# Altium project doc_high-speed-thermocouple-logger.PrjPcb (part 1 of 3)
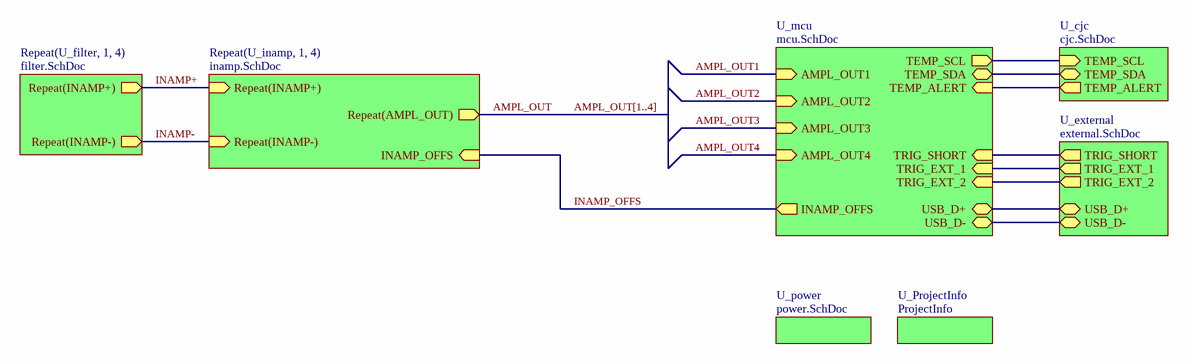
[diagram p0: Top.SchDoc]
CheckedBy: Boris Botev; Date: 2024-05-30; DrawnBy: Iliyan Antov; DrawnByID: IA; Project: V286; Revision: 100; Title: tclogger
8 sheets, 226 parts. Net scope: hierarchical (ports join the sheet entries above them; power ports are global).
Sheets:
  Top.SchDoc
    U_ProjectInfo = ProjectInfo.SchDoc
    U_filter1 = filter.SchDoc
    U_filter2 = filter.SchDoc
    U_filter3 = filter.SchDoc
    U_filter4 = filter.SchDoc
    U_power = power.SchDoc
    U_mcu = mcu.SchDoc
    U_external = external.SchDoc
  C_76p593.SchDoc
  C_376p667.SchDoc

## Sheet Top.SchDoc: tclogger
size A4; Date: 2024-05-30; CheckedBy: Boris Botev; DrawnBy: Iliyan Antov; Organization: Medical Technologies CZ a.s.; Revision: 100; SheetNumber: 1; SheetTotal: 10; Version1: N/A; Version2: N/A; Version3: N/A; Change1description: N/A; Change2description: N/A; Change3description: N/A; Change1DrawnBy: N/A; Change2DrawnBy: N/A; Change3DrawnBy: N/A; Change1CheckedBy: N/A; Change2CheckedBy: N/A; Change3CheckedBy: N/A; PreviusVersion_Chng1: N/A; PreviusVersion_Chng2: N/A; PreviusVersion_Chng3: N/A; Variant1description: Standard assembly; Variant2description: N/A; Variant3description: N/A; Variant4description: N/A; PrimaryCard1: XXXxxxXXX; PrimaryCard2: N/A; PrimaryCard3: N/A; PrimaryCard4: N/A; DocumentName: Docname

### Sub-sheets
Repeat(U_filter, 1, 4) = filter.SchDoc: Repeat(INAMP+) (out), Repeat(INAMP-) (out)
Repeat(U_inamp, 1, 4) = inamp.SchDoc (file not in this document): Repeat(INAMP-) (in), Repeat(INAMP+) (in), Repeat(AMPL_OUT) (out), INAMP_OFFS (in)
U_cjc = cjc.SchDoc (file not in this document): TEMP_SCL (in), TEMP_SDA (bidir), TEMP_ALERT (out)
U_external = external.SchDoc: USB_D+ (bidir), USB_D- (bidir), TRIG_SHORT (out), TRIG_EXT_1 (out), TRIG_EXT_2 (out)
U_mcu = mcu.SchDoc: AMPL_OUT1 (in), AMPL_OUT2 (in), AMPL_OUT3 (in), AMPL_OUT4 (in), TEMP_ALERT (in), TEMP_SCL (out), TEMP_SDA (bidir), USB_D+ (bidir), USB_D- (bidir), TRIG_SHORT (in), TRIG_EXT_1 (in), TRIG_EXT_2 (in), INAMP_OFFS (out)
U_power = power.SchDoc: no entries
U_ProjectInfo = ProjectInfo: no entries

### Nets
AMPL_OUT: sheet Repeat(U_inamp, 1, 4)/Repeat(AMPL_OUT)
INAMP+: sheet Repeat(U_filter, 1, 4)/Repeat(INAMP+), sheet Repeat(U_inamp, 1, 4)/Repeat(INAMP+)
INAMP-: sheet Repeat(U_filter, 1, 4)/Repeat(INAMP-), sheet Repeat(U_inamp, 1, 4)/Repeat(INAMP-)
INAMP_OFFS: sheet Repeat(U_inamp, 1, 4)/INAMP_OFFS, sheet U_mcu/INAMP_OFFS
USB_D_N: sheet U_mcu/USB_D-, sheet U_external/USB_D-
USB_D_P: sheet U_mcu/USB_D+, sheet U_external/USB_D+
NetCK41_1: sheet U_mcu/TRIG_SHORT, sheet U_external/TRIG_SHORT
NetR29_1: sheet U_mcu/TRIG_EXT_1, sheet U_external/TRIG_EXT_1
NetR30_1: sheet U_mcu/TRIG_EXT_2, sheet U_external/TRIG_EXT_2
NetU7_40: sheet U_cjc/TEMP_SCL, sheet U_mcu/TEMP_SCL
NetU7_41: sheet U_cjc/TEMP_SDA, sheet U_mcu/TEMP_SDA
NetU7_42: sheet U_cjc/TEMP_ALERT, sheet U_mcu/TEMP_ALERT

### Buses and harness runs
bus AMPL_OUT[1..4]

### Notes on the sheet
- Číslo výkresu /drawing number/:
- Nazev listu/sheet name/:
- DPS projekt/PCB project/:
- Kreslil /drawn by/ :
- Kontroloval /checked by/:
- Datum /date/:
- List /sheet/:
- /

## Sheet ProjectInfo.SchDoc: tclogger
size A4; Date: 2024-05-30; CheckedBy: Boris Botev; DrawnBy: Iliyan Antov; Organization: Medical Technologies CZ a.s.; DocumentNumber: ?; Revision: 100; SheetNumber: 2; SheetTotal: 10; Version1: N/A; Version2: N/A; Version3: N/A; Change1description: N/A; Change2description: N/A; Change3description: N/A; Change1DrawnBy: N/A; Change2DrawnBy: N/A; Change3DrawnBy: N/A; Change1CheckedBy: N/A; Change2CheckedBy: N/A; Change3CheckedBy: N/A; PreviusVersion_Chng1: N/A; PreviusVersion_Chng2: N/A; PreviusVersion_Chng3: N/A; Variant1description: Standard assembly; Variant2description: N/A; Variant3description: N/A; Variant4description: N/A; PrimaryCard1: XXXxxxXXX; PrimaryCard2: N/A; PrimaryCard3: N/A; PrimaryCard4: N/A; DocumentName: Docname
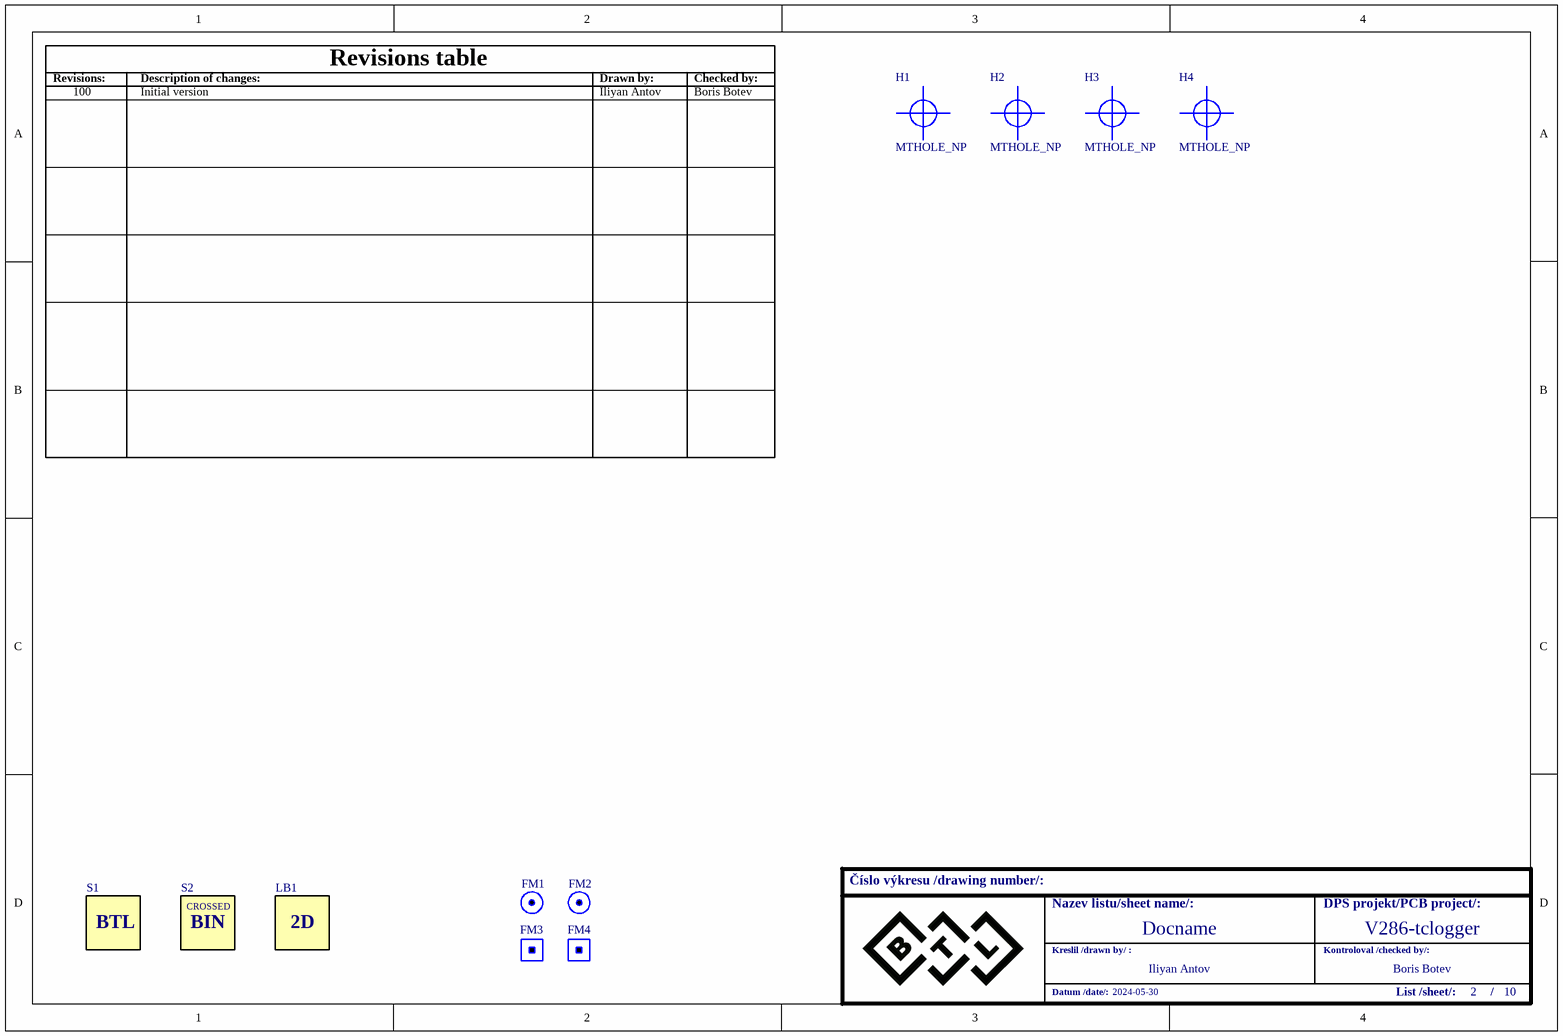
[diagram p1: ProjectInfo.SchDoc]

### Parts
FM1  Fiducial Mark Circle  [FM_CIRCLE_BTL]  (value not drawn)
FM2  Fiducial Mark Circle  [FM_CIRCLE_BTL]  (value not drawn)
FM3  Fiducial Mark Square  [FM_SQUARE_BTL]  (value not drawn)
FM4  Fiducial Mark Square  [FM_SQUARE_BTL]  (value not drawn)
H1  MTHOLE_NP  [HOLE3.5MM_NONPLATED]  (no BOM)
H2  MTHOLE_NP  [HOLE3.5MM_NONPLATED]  (no BOM)
H3  MTHOLE_NP  [HOLE3.5MM_NONPLATED]  (no BOM)
H4  MTHOLE_NP  [HOLE3.5MM_NONPLATED]  (no BOM)
LB1  LABEL_MATRIX_CODE  [MATRIX_CODE]  (value not drawn)  (no BOM)
S1  SYMBOL_LOGO_BTL  [BTL_LOGO_3MM]  (value not drawn)  (no BOM)
S2  SYMBOL_CROSSED_BIN  [CROSSED_BIN]  (value not drawn)  (no BOM)

### Nets

Not connected (* = marked no-connect by the designer): H1 #; H2 #; H3 #; H4 #

### Notes on the sheet
- Revisions:
- 100
- Description of changes:
- Initial version
- Revisions table
- Drawn by:
- Iliyan Antov
- Checked by:
- Boris Botev
- Číslo výkresu /drawing number/:
- Nazev listu/sheet name/:
- DPS projekt/PCB project/:
- Kreslil /drawn by/ :
- Kontroloval /checked by/:
- Datum /date/:
- List /sheet/:
- /
- (in symbol 000-SPACE2D100) 2D
- (in symbol 000-SYMBIN100) CROSSED; BIN
- (in symbol 000-SYMBTL100) BTL

### Library data of the parts
FM1 FM2 = 000+FMC100: De; Fiducial Mark;; Component_Class: Design Entity; Status_I: Development; Status_II: Testing; KK: 000+FMC100; Value: Fiducial Mark Circle; SMD: 1; Entity_Type: Fiducial Mark; ComponentLink1URL: heliosgreen://v1/hegMT/5-MT/Classes(343)/Folders/OpenForm?RecordNumbers=[12022158]; ComponentLink1Description: Helios
FM3 FM4 = 000+FMS100: De; Fiducial Mark;; Component_Class: Design Entity; Status_I: Development; Status_II: Testing; KK: 000+FMS100; Value: Fiducial Mark Square; SMD: 1; Entity_Type: Fiducial Mark; ComponentLink1URL: heliosgreen://v1/hegMT/5-MT/Classes(343)/Folders/OpenForm?RecordNumbers=[12022164]; ComponentLink1Description: Helios
H1-H4 = 000-HOLE3.5NP100: De; Hole;; Note: Hole 3,5mm, Nonplated; Component_Class: Design Entity; Status_I: Development; Status_II: Approval pending; KK: 000-HOLE3.5NP100; Value: MTHOLE_NP; SMD: 0; Entity_Type: Hole; ComponentLink1URL: heliosgreen://v1/hegMT/5-MT/Classes(343)/Folders/OpenForm?RecordNumbers=[13035934]; ComponentLink1Description: Helios
LB1 = 000-SPACE2D100: De; Space for...;; Note: Space for 2D code sticker; Component_Class: Design Entity; Status_I: Development; Status_II: Testing; KK: 000-SPACE2D100; Value: LABEL_MATRIX_CODE; SMD: 0; Entity_Type: Space for...; ComponentLink1URL: heliosgreen://v1/hegMT/5-MT/Classes(343)/Folders/OpenForm?RecordNumbers=[12022194]; ComponentLink1Description: Helios
S1 = 000-SYMBTL100: De; Symbols/Tables;; Note: Symbol BTL logos for silkscreen or Copper; Component_Class: Design Entity; Status_I: Development; Status_II: Testing; KK: 000-SYMBTL100; Value: SYMBOL_LOGO_BTL; SMD: 0; Entity_Type: Symbols/Tables; ComponentLink1URL: heliosgreen://v1/hegMT/5-MT/Classes(343)/Folders/OpenForm?RecordNumbers=[12022368]; ComponentLink1Description: Helios
S2 = 000-SYMBIN100: De; Symbols/Tables;; Note: Symbol Crossed Bin; Component_Class: Design Entity; Status_I: Development; Status_II: Testing; KK: 000-SYMBIN100; Value: SYMBOL_CROSSED_BIN; SMD: 0; Entity_Type: Symbols/Tables; ComponentLink1URL: heliosgreen://v1/hegMT/5-MT/Classes(343)/Folders/OpenForm?RecordNumbers=[12022356]; ComponentLink1Description: Helios

## Sheet filter.SchDoc: tclogger
size A4; Date: 2024-05-30; CheckedBy: Boris Botev; DrawnBy: Iliyan Antov; Organization: Medical Technologies CZ a.s.; Revision: 100; SheetNumber: 4; SheetTotal: 10; Version1: N/A; Version2: N/A; Version3: N/A; Change1description: N/A; Change2description: N/A; Change3description: N/A; Change1DrawnBy: N/A; Change2DrawnBy: N/A; Change3DrawnBy: N/A; Change1CheckedBy: N/A; Change2CheckedBy: N/A; Change3CheckedBy: N/A; PreviusVersion_Chng1: N/A; PreviusVersion_Chng2: N/A; PreviusVersion_Chng3: N/A; Variant1description: Standard assembly; Variant2description: N/A; Variant3description: N/A; Variant4description: N/A; PrimaryCard1: XXXxxxXXX; PrimaryCard2: N/A; PrimaryCard3: N/A; PrimaryCard4: N/A; SPICEModelCacheFNHWHFZR: <root> / <DocumentId>FNHWHFZR</DocumentId> / <CacheFrame Number="0"> / <Model Name="1812_744235110_5000ohm" Kind="CKT"> / <Text>.subckt 1812_744235110_5000ohm 1 2 3 4  PARAMS: / +  L1=8.85047647829296E-06 / +  L2=0.0000034430683879953 / +  L3=3.38096411330201E-08 / +  L4=1.00652585896406E-08 / +  C1=1.31229796204887E-13 / +  RS1=7427.18723080165 / +  RS2=1810.64222257634 / +  RS3=34746.6565929217 / +  RS4=3695.42782092552 / +  R2=216.5 / +  DL3=2.01815820812556E-09 / +  DC3=3.07079198420314E-12 / +  DR3=155.69656586632 / +  DR4=156.010213182894 / +  Rdc=0.501580452433977 / +  ck=2.0478163676467E-11 / R_R47  N21893  N21911  {Rs3} / R_R43  N21425  N21441  {Rs2} / R_R4  N22217  N21871  {dR3} / L_L3  N21425  N21441  {L2} / L_L8  N21871  N21893  {L4} / Kn_K1  L_L1  L_L2  1 / R_R37  N21241  3  {R2} / R_R48  N21911  N21925  {Rs2} / R_R44  N21441  3  {Rs1} / C_C4  N21871  N22231  {C1} / L_L1  N21441  3  {L1} / C_C1  N21207  N21217  {dC3} / L_L6  N21893  N21911  {L3} / R_R1  1  N21207  {Rdc} / L_L17  N21207  N21585  {dL3} / R_R49  N21925  4  {Rs1} / Kn_K5 L_L17 L_L18 0.9999 / Kn_K6 L_L17 L_L19 0.9999 / Kn_K7 L_L17 L_L20 0.9999 / Kn_K8 L_L18 L_L19 0.9999 / Kn_K9 L_L18 L_L20 0.9999 / Kn_K10 L_L19 L_L20 0.9999 / R_R3  N21217  N21223  {dR3} / R_R55  N22231  4  {R2} / L_L4  N21911  N21925  {L2} / R_R2  N21207  N21223  {dR4} / L_L19  N21585  N21223  {dL3} / R_R6  2  N21857  {Rdc} / C_C2  N21731  N21585  {ck} / Kn_K4  L_L7  L_L8  1 / L_L2  N21925  4  {L1} / R_R41  N21223  N21413  {Rs4} / L_L7  N21223  N21413  {L4} / R_R5  N21857  N21871  {dR4} / L_L18  N21731  N21857  {dL3} / Kn_K3  L_L5  L_L6  1 / R_R46  N21871  N21893  {Rs4} / R_R42  N21413  N21425  {Rs3} / L_L5  N21413  N21425  {L3} / C_C9  N21857  N22217  {dC3} / L_L20  N21871  N21731  {dL3} / Kn_K2  L_L3  L_L4  1 / C_C3  N21223  N21241  {C1} / .ends 1812_744235110_5000ohm</Text> / </Model> / <Model Name="cl10b224ko8nnn" Kind="CKT"> / <Text>* CL10B224KO8NNN Multilayer Ceramic Capacitor Spice Model / *----------------------------------------------------------------------------------------------- / * Model Generated by Samsung Electro-Mechanics / * Samsung Spice Model Version 5.0 / * Date : Sep-26-2020 / * Products : Multilayer Ceramic Capacitor(General) / *----------------------------------------------------------------------------------------------- / * Characteristics : / * / *     Nominal Capacitance = 220nF / *     Capacitance Tolerance = +/-10% / *     TCC = X7R(-55 ~ +125 degC.) / *     Rated Voltage = 16Vdc / *     Size = 0603(unit:inch), 1608(unit:mm) / *     Length = 1.60+/-0.10mm / *     Width = 0.80+/-0.10mm / *     Thickness = 0.80+/-0.10mm / *     Measurement Temperature : 25degC. / *     DC bias Value = 0V / *     Frequency : 300Hz ~ 6GHz / *----------------------------------------------------------------------------------------------- / * External Node Assignments : / * / *  1  o---||---o  2 / * / *----------------------------------------------------------------------------------------------- / .SUBCKT CL10B224KO8NNN 1 2 / C1 1 3 2.12811E-7 / C2 3 4 4.50839E-6 / C3 4 5 7.37628E-6 / C4 5 6 1.15740E-5 / C5 6 7 8.21856E-6 / C6 7 8 1.49560E-6 / C7 8 9 1.0E-10 / C8 9 10 1.0E-10 / C16 17 18 4.28299E-5 / C17 18 19 0.00218 / C18 19 20 2.53303E-4 / C19 20 21 2.53303E-4 / C20 21 22 2.53303E-4 / C21 22 23 2.53303E-4 / C22 23 24 2.53303E-4 / C23 24 25 1.40386E-6 / C24 25 26 2.45886E-7 / C25 26 27 2.53303E-4 / C26 27 28 7.70224E-12 / C27 28 2 9.10213E-12 / L10 11 12 1.06621E-10 / L11 12 13 1.56523E-10 / L12 13 14 2.14472E-11 / L13 14 15 1.0E-10 / L14 15 16 1.0E-10 / L15 16 17 1.0E-10 / L16 17 18 3.49236E-10 / L17 18 19 2.37243E-12 / L18 19 20 1.0E-10 / L19 20 21 1.0E-10 / L20 21 22 1.0E-10 / L21 22 23 1.0E-10 / L22 23 24 1.0E-10 / L23 24 25 1.67603E-11 / L24 25 26 4.35819E-11 / L25 26 27 1.0E-10 / L26 27 28 5.54700E-11 / L27 28 2 9.20069E-11 / R1 1 3 1.0E8 / R2 3 4 164.97574 / R3 4 5 8.00726 / R4 5 6 0.53476 / R5 6 7 0.05878 / R6 7 8 0.00650 / R7 8 9 1.0E-6 / R8 9 10 1.0E-6 / R9 10 11 0.00774 / R11 12 13 0.06260 / R12 13 14 0.08187 / R13 14 15 1.0E-6 / R14 15 16 1.0E-6 / R15 16 17 1.0E-6 / R16 17 18 0.00281 / R17 18 19 9.83794E-4 / R18 19 20 1.0E-6 / R19 20 21 1.0E-6 / R20 21 22 1.0E-6 / R21 22 23 1.0E-6 / R22 23 24 1.0E-6 / R23 24 25 0.01140 / R24 25 26 0.02076 / R25 26 27 1.0E-6 / R26 27 28 23.64485 / R27 28 2 6.29425 / .ENDS CL10B224KO8NNN</Text> / </Model> / </CacheFrame> / </root>; DocumentName: Docname
Used 4 times, as channels U_filter1, U_filter2, U_filter3, U_filter4. Parts and nets are listed once, with the designators drawn on the sheet.
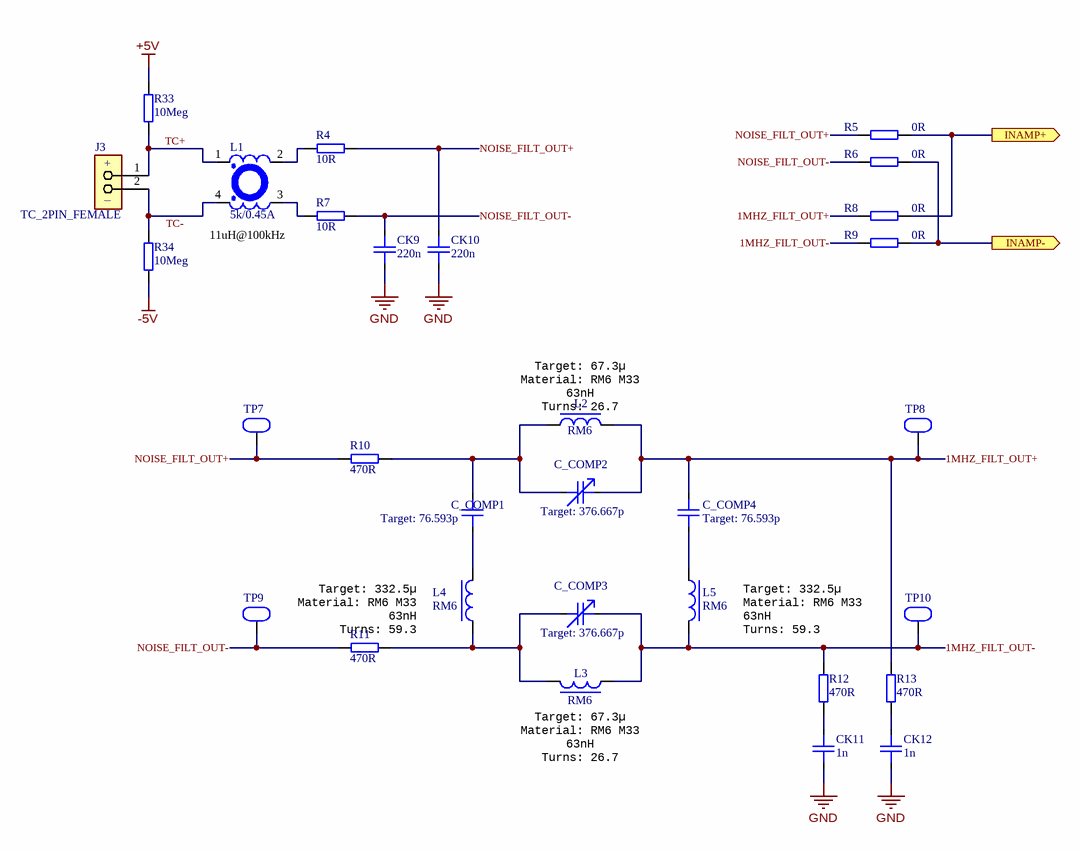
[diagram p2: filter.SchDoc]

### Parts
C_COMP1  Target: 76.593p  [CAPC1005X06N(SMC0402)]
C_COMP2  Target: 376.667p  [CTSC3S]
C_COMP3  Target: 376.667p  [CTSC3S]
C_COMP4  Target: 76.593p  [CAPC1005X06N(SMC0402)]
CK9  220n  [CAPC1608X09N(SMC0603)]
CK10  220n  [CAPC1608X09N(SMC0603)]
CK11  1n  [CAPC2012X14N(SMC0805)]
CK12  1n  [CAPC2012X14N(SMC0805)]
J3  TC_2PIN_FEMALE  [TC_PCC-SMD]
L1  5k/0.45A  [WE_744235110]
L2  RM6  [INDP1616X10N]
L3  RM6  [INDP1616X10N]
L4  RM6  [INDP1616X10N]
L5  RM6  [INDP1616X10N]
R4  10R  [RESC2012X06N(SMR0805)]
R5  0R  [RESC2012X06N(SMR0805)]
R6  0R  [RESC2012X06N(SMR0805)]
R7  10R  [RESC2012X06N(SMR0805)]
R8  0R  [RESC2012X06N(SMR0805)]
R9  0R  [RESC2012X06N(SMR0805)]
R10  470R  [RESC1608X06N(SMR0603)]
R11  470R  [RESC1608X06N(SMR0603)]
R12  470R  [RESC1608X06N(SMR0603)]
R13  470R  [RESC1608X06N(SMR0603)]
R33  10Meg  [RESC2012X06N(SMR0805)]
R34  10Meg  [RESC2012X06N(SMR0805)]
TP7  Test Point  [SMD_Testpoint_Onelayer]  (value not drawn)
TP8  Test Point  [SMD_Testpoint_Onelayer]  (value not drawn)
TP9  Test Point  [SMD_Testpoint_Onelayer]  (value not drawn)
TP10  Test Point  [SMD_Testpoint_Onelayer]  (value not drawn)

### Ports
INAMP+ (out), INAMP- (out)

### Nets
+5V: R33.2
-5V: R34.1
GND: CK9.2 CK10.2 CK11.1 CK12.1
1MHZ_FILT_OUT+: C_COMP2.1 C_COMP4.1 L2.2(L1B) R8.1 R13.2 TP8.1
1MHZ_FILT_OUT-: C_COMP3.1 L3.2(L1B) L5.1(L1A) R9.1 R12.2 TP10.1
INAMP+: R5.2 R8.2 ; port INAMP+
INAMP-: R6.2 R9.2 ; port INAMP-
NOISE_FILT_OUT+: CK10.1 R4.1 R5.1 R10.1 TP7.1
NOISE_FILT_OUT-: CK9.1 R6.1 R7.2 R11.1 TP9.1
TC+: J3.1 L1.1(L1A) R33.1
TC-: J3.2 L1.4(L2B) R34.2
NetC_COMP1_1: C_COMP1.1 C_COMP2.2 L2.1(L1A) R10.2
NetC_COMP1_2: C_COMP1.2 L4.2(L1B)
NetC_COMP3_2: C_COMP3.2 L3.1(L1A) L4.1(L1A) R11.2
NetC_COMP4_2: C_COMP4.2 L5.2(L1B)
NetCK11_2: CK11.2 R12.1
NetCK12_2: CK12.2 R13.1
NetL1_2: L1.2(L1B) R4.2
NetL1_3: L1.3(L2A) R7.1

### Channels
U_filter1: designators end in A; ports INAMP+=INAMP+1 INAMP-=INAMP-1
U_filter2: designators end in B; ports INAMP+=INAMP+2 INAMP-=INAMP-2
U_filter3: designators end in C; ports INAMP+=INAMP+3 INAMP-=INAMP-3
U_filter4: designators end in D; ports INAMP+=INAMP+4 INAMP-=INAMP-4

### Notes on the sheet
- 11uH@100kHz
- (near L2) Target: 67.3µ
  Material: RM6 M33 63nH
  Turns: 26.7
- (near TP9) Target: 332.5µ
  Material: RM6 M33 63nH
  Turns: 59.3
- (near TP10) Target: 332.5µ
  Material: RM6 M33 63nH
  Turns: 59.3
- (near L3) Target: 67.3µ
  Material: RM6 M33 63nH
  Turns: 26.7
- Číslo výkresu /drawing number/:
- Nazev listu/sheet name/:
- DPS projekt/PCB project/:
- Kreslil /drawn by/ :
- Kontroloval /checked by/:
- Datum /date/:
- List /sheet/:
- /
- (in symbol TC_2PIN_FEMALE) +; –

### Library data of the parts
C_COMP1 C_COMP4 = ECK+470P50V0402XX0: C; 470p; 50V; 1%; NP0/C0G; ??;; Manufacturer: Kemet: C0402C471F5GAC7867;;Murata: GRM1555C1H471FA01D; Component_Class: Capacitor; Status_I: Production; Status_II: Active; Tolerance_Pct: 1; Voltage_Rating_V: 50; Capacitance_F: 4.7E-10; KK: ECK+470P50V0402XX0; Value: 470p; SMD: 1; ComponentLink2URL: I:\DataSheets\ECK+470P50V0402XX0_KemetEN100.pdf; ComponentLink2Description: ECK+470P50V0402XX0_KemetEN100.pdf; ComponentLink3URL: I:\DataSheets\ECK+470P50V0402XX0_MurataEN100.pdf; ComponentLink3Description: ECK+470P50V0402XX0_MurataEN100.pdf; ComponentLink4URL: i:\DataSheets\ECK+470P50V0402XX0_2_KemetEN100.pdf; ComponentLink4Description: ECK+470P50V0402XX0_2_KemetEN100.pdf; ComponentLink5URL: i:\DataSheets\ECK+470P50V0402XX0_2_MurataEN100.pdf; ComponentLink5Description: ECK+470P50V0402XX0_2_MurataEN100.pdf; Dielectric_Type: NP0/C0G; ComponentLink1URL: heliosgreen://v1/hegMT/5-MT/Classes(343)/Folders/OpenForm?RecordNumbers=[14965054]; ComponentLink1Description: Helios
C_COMP2 C_COMP3 = CTSC3S: 3.5 - 10pF, 50V; ComponentLink1Description: Datasheet; ComponentLink1URL: https://store.comet.bg/download-file.php?id=2362; Value: 3.5 - 10pF
CK9 CK10 = ECK+220N16VXX0: C; 220n; 16V; 10%; X7R; ??;; Manufacturer: TDK Corporation: C1608X7R1C224K080AC;;AVX Corporation: 0603YC224KAT2A;;Samsung: CL10B224KO8NNNC; Component_Class: Capacitor; Status_I: Production; Status_II: Active; Tolerance_Pct: 10; Voltage_Rating_V: 16; Capacitance_F: 2.2E-7; KK: ECK+220N16VXX0; Value: 220n; SMD: 1; ComponentLink2URL: i:\DataSheets\ECK+220N16VXX0_TDKEN100.pdf; ComponentLink2Description: ECK+220N16VXX0_TDKEN100.pdf; ComponentLink3URL: I:\DataSheets\ECK+220N16VXX0_AVXCorporationEN100.pdf; ComponentLink3Description: ECK+220N16VXX0_AVXCorporationEN100.pdf; ComponentLink4URL: I:\DataSheets\ECK+220N16VXX0_SamsungEN100.pdf; ComponentLink4Description: ECK+220N16VXX0_SamsungEN100.pdf; ComponentLink5URL: i:\DataSheets\ECK+220N16VXX0_2_SamsungEN100.pdf; ComponentLink5Description: ECK+220N16VXX0_2_SamsungEN100.pdf; Dielectric_Type: X7R; ComponentLink1URL: heliosgreen://v1/hegMT/5-MT/Classes(343)/Folders/OpenForm?RecordNumbers=[9390379]; ComponentLink1Description: Helios
CK11 CK12 = ECK+1N50VXXJ: C; 1n; 50V; 5%; NP0/C0G; ??;; Manufacturer: YAGEO: CC0805JRNPO9BN102;;AVX: 0805 5A 102 JAT2A; Component_Class: Capacitor; Status_I: Production; Status_II: Active; Tolerance_Pct: 5; Voltage_Rating_V: 50; Capacitance_F: 1E-9; KK: ECK+1N50VXXJ; Value: 1n; SMD: 1; ComponentLink2URL: i:\datasheets\ECK+1N50VXXJ_Yageo.pdf; ComponentLink2Description: ECK+1N50VXXJ_Yageo.pdf; ComponentLink3URL: i:\DataSheets\ECK+1N50VXXJ_2_YageoEN100.pdf; ComponentLink3Description: ECK+1N50VXXJ_2_YageoEN100.pdf; ComponentLink4URL: i:\DataSheets\ECK+1N50VXXJ_AVX_EN100.pdf; ComponentLink4Description: ECK+1N50VXXJ_AVX_EN100.pdf; Dielectric_Type: NP0/C0G; ComponentLink1URL: heliosgreen://v1/hegMT/5-MT/Classes(343)/Folders/OpenForm?RecordNumbers=[380366]; ComponentLink1Description: Helios
J3 = TC_2PIN_FEMALE: Universal SMD thermocouple connector, 2 pin, Female; Value: TC_2PIN_FEMALE; ComponentLink1Description: Datasheet; ComponentLink1URL: https://www.farnell.com/datasheets/2913879.pdf
L1 = EL+11U0.45ACM1812XX0: Flt; Common Mode Chokes; 0.8Ohm; 0.45A; 60V; 1x;; Manufacturer: Würth: 744235110; Note: 11uH, 0.45A, 5k@100MHz; Component_Class: Filter; Status_I: Production; Status_II: Active; Multiplicity: 1; Voltage_Rating_V: 60; Resistance_Ohm: 0.8; Current_Rating_A: 0.45; Mounting_Style: PCB; KK: EL+11U0.45ACM1812XX0; Value: 5k/0.45A; SMD: 1; ComponentLink2URL: i:\DataSheets\EL+11U0.45ACM1812XX0_WurthEN100.pdf; ComponentLink2Description: EL+11U0.45ACM1812XX0_WurthEN100.pdf; Filter_Type: Common Mode Chokes; ComponentLink1URL: heliosgreen://v1/hegMT/5-MT/Classes(343)/Folders/OpenForm?RecordNumbers=[12661641]; ComponentLink1Description: Helios
L2-L5 = EL+0.47U1.7AXX0: L; 0.47uH; 1.7A; 30%; 0.101Ohm; Fe; 1x;; Manufacturer: Wurth Elektronik: 784383130047; Component_Class: Inductor; Status_I: Production; Status_II: Do not order. Upon confirmation.; Tolerance_Pct: 30; Multiplicity: 1; Resistance_Ohm: 0.101; Current_Rating_A: 1.7; Inductance_H: 4.7E-7; KK: EL+0.47U1.7AXX0; Value: 0.47uH; SMD: 1; ComponentLink2URL: I:\DataSheets\EL+0.47U1.7AXX0_WurthElektronik_EN100.pdf; ComponentLink2Description: EL+0.47U1.7AXX0_WurthElektronik_EN100.pd; Core_Material: Fe; ComponentLink1URL: heliosgreen://v1/hegMT/5-MT/Classes(343)/Folders/OpenForm?RecordNumbers=[18782770]; ComponentLink1Description: Helios
R4 R7 = ER+10R0.1WXXF: R; 10R; 0.125W; 1%; 150V; Thick Film; ±200ppm/K; 1x;; Manufacturer: YAGEO: RC0805FR-1010RL;;YAGEO: RC0805FR-0710RL;;YAGEO: RC0805FR-1310RL;;AVX: CR21-0100F-T;;BC Components: MCU0805-50 1% P5 10R;;SAMSUNG: RC2012F100CS; Component_Class: Resistor; Status_I: Production; Status_II: Active; Tolerance_Pct: 1; Voltage_Rating_V: 150; Resistance_Ohm: 10; Power_Rating_W: 0.125; Temperature_Coefficient_PPMpK: ±200; KK: ER+10R0.1WXXF; Value: 10R; SMD: 1; ComponentLink2URL: i:\DataSheets\ER+0.1WXXF_Yageo.pdf; ComponentLink2Description: ER+0.1WXXF_Yageo.pdf; ComponentLink3URL: i:\datasheets\ER+10R0.1WXXF_SamsungEN100.pdf; ComponentLink3Description: ER+10R0.1WXXF_SamsungEN100.pdf; ComponentLink4URL: i:\DataSheets\ER+10R0.1WXXF_AvxEN100.pdf; ComponentLink4Description: ER+10R0.1WXXF_AvxEN100; Multiplicity: 1; Resistor_Type: Thick Film; ComponentLink1URL: heliosgreen://v1/hegMT/5-MT/Classes(343)/Folders/OpenForm?RecordNumbers=[381485]; ComponentLink1Description: Helios
R5 R6 R8 R9 = ER+0RXX1: R; 0R; 0.125W; 1%; 150V; Thick Film; ±200ppm/K; 1x;; Manufacturer: YAGEO: RC0805JR-100RL;;YAGEO: RC0805JR-130RL;;YAGEO: RC0805JR-070RL; Component_Class: Resistor; Status_I: Production; Status_II: Active; Tolerance_Pct: 1; Voltage_Rating_V: 150; Resistance_Ohm: 0; Power_Rating_W: 0.125; Temperature_Coefficient_PPMpK: ±200; KK: ER+0RXX1; Value: 0R; SMD: 1; ComponentLink2URL: i:\DataSheets\ER+0.1WXXF_Yageo.pdf; ComponentLink2Description: ER+0.1WXXF_Yageo.pdf; Multiplicity: 1; Resistor_Type: Thick Film; ComponentLink1URL: heliosgreen://v1/hegMT/5-MT/Classes(343)/Folders/OpenForm?RecordNumbers=[381470]; ComponentLink1Description: Helios
R10-R13 = ER+470R0.1WXX2: R; 470R; 0.1W; 1%; 75V; Thick Film; ±100ppm/K; 1x;; Manufacturer: Yageo: RC0603FR-07470RL;;Panasonic: ERJ3EKF4700V; Component_Class: Resistor; Status_I: Production; Status_II: Active; Tolerance_Pct: 1; Voltage_Rating_V: 75; Resistance_Ohm: 470; Power_Rating_W: 0.1; Temperature_Coefficient_PPMpK: ±100; KK: ER+470R0.1WXX2; Value: 470R; SMD: 1; ComponentLink2URL: I:\DataSheets\ER+470R0.1WXX2_YageoEN100.pdf; ComponentLink2Description: ER+470R0.1WXX2_YageoEN100.pdf; ComponentLink3URL: I:\datasheets\ER+470R0.1WXX2_PanasonicEN100.pdf; ComponentLink3Description: ER+470R0.1WXX2_PanasonicEN100.pdf; Multiplicity: 1; Resistor_Type: Thick Film; ComponentLink1URL: heliosgreen://v1/hegMT/5-MT/Classes(343)/Folders/OpenForm?RecordNumbers=[11656564]; ComponentLink1Description: Helios
R33 R34 = ER+10M0.1WXXJ: R; 10Meg; 0.125W; 5%; 150V; Thick Film; ±100ppm/K; 1x;; Manufacturer: YAGEO: RC0805JR-0710ML;;BC Components: MCU0805-50 1% P5 10M;;PANASONIC: ERJ 6GE Y J 106 V; Component_Class: Resistor; Status_I: Production; Status_II: Active; Tolerance_Pct: 5; Multiplicity: 1; Voltage_Rating_V: 150; Resistance_Ohm: 10000000; Power_Rating_W: 0.125; Temperature_Coefficient_PPMpK: ±100; KK: ER+10M0.1WXXJ; Value: 10Meg; SMD: 1; ComponentLink2URL: i:\DataSheets\ER+1WXXJ_Yageo.pdf; ComponentLink2Description: ER+1WXXJ_Yageo.pdf; ComponentLink3URL: i:\DataSheets\ER+10M0.1WXXJ_VishayEN100.pdf; ComponentLink3Description: ER+10M0.1WXXJ_VishayEN100; ComponentLink4URL: i:\DataSheets\ER+10M0.1WXXJ_PanasonicEN100.pdf; ComponentLink4Description: ER+10M0.1WXXJ_PanasonicEN100; Resistor_Type: Thick Film; ComponentLink1URL: heliosgreen://v1/hegMT/5-MT/Classes(343)/Folders/OpenForm?RecordNumbers=[381483]; ComponentLink1Description: Helios
TP7-TP10 = EJ+TESTPOINTXX0: Con; Test Point; 1x; PCB; ??; ??V; ??A; ??; Tin; Contact;; Manufacturer: Harwin: S1751-46R; Component_Class: Connector; Status_I: Production; Status_II: Active; Multiplicity: 1; KK: EJ+TESTPOINTXX0; Value: Test Point; SMD: 1; ComponentLink2URL: i:\datasheets\EJ+TESTPOINTXX0_HarwinEN100.pdf; ComponentLink2Description: EJ+TESTPOINTXX0_HarwinEN100.pdf; ComponentLink3URL: i:\datasheets\EJ+TESTPOINTXX0_BoardWareEN100.pdf; ComponentLink3Description: EJ+TESTPOINTXX0_BoardWareEN100.pdf; Mounting_Style: PCB; Connector_Family: Test Point; Plating: Tin; Connector_Part: Contact; ComponentLink1URL: heliosgreen://v1/hegMT/5-MT/Classes(343)/Folders/OpenForm?RecordNumbers=[5618398]; ComponentLink1Description: Helios; System: Connector